# EAGLE schematic monarchdtv (EAGLE 9.6.2)
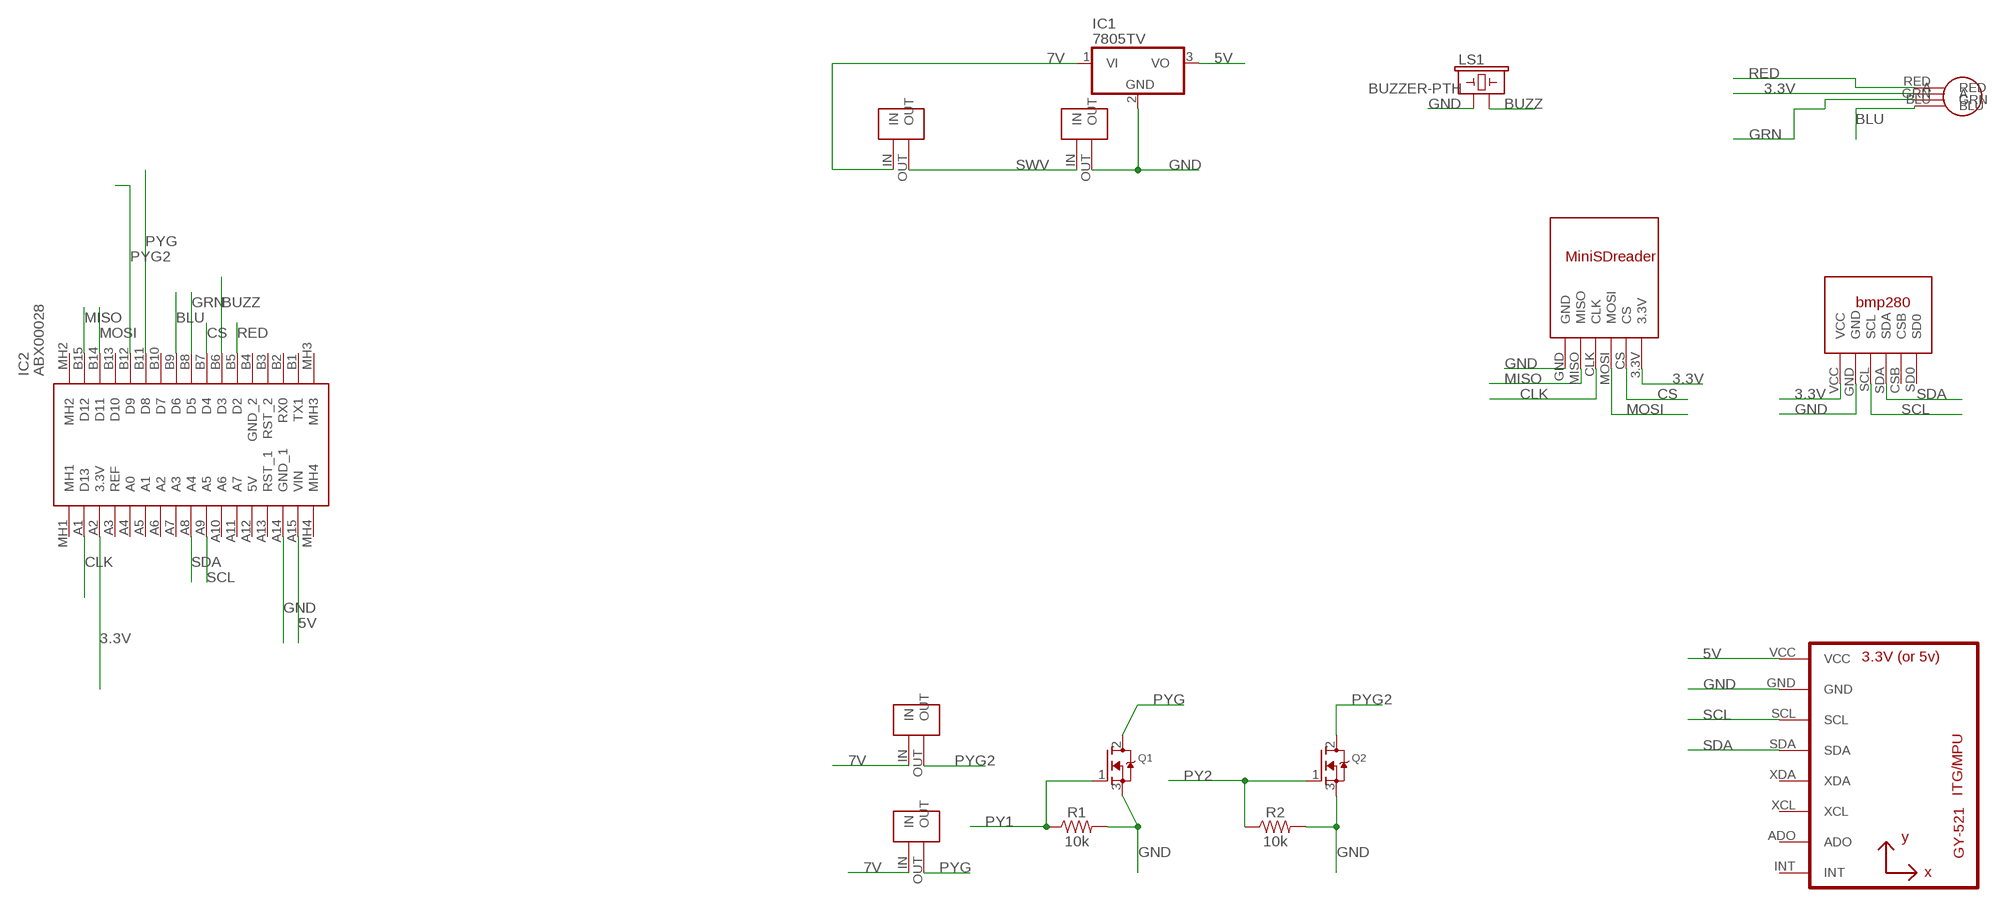
[diagram p0: schematic, sheet 1]

## Parts
IC1  7805TV  [TO220V]
IC2  ABX00028  [ABX00028]
LS1  BUZZER-PTH  [BUZZER-12MM]
Q1  MOSFET-NGDS_TO220V  [TO220V]
Q2  MOSFET-NGDS_TO220V  [TO220V]
R1  10k  10KOHM-VERT_KIT-1/6W-5%  [AXIAL-0.1-KIT]
R2  10k  10KOHM-VERT_KIT-1/6W-5%  [AXIAL-0.1-KIT]
U1  GY-521MPU6050  [GY-521]
U$2  BMP280  [BMP280]
U$3  MINISDREADER  [MINISDREADER]
U$4  SWITCH  [SWITCH]
U$5  SWITCH  [SWITCH]
U$6  SWITCH  [SWITCH]
U$7  SWITCH  [SWITCH]
U$9  LED  [LED]

## Nets
3.3V: IC2.A2(3.3V) U$2.VCC U$3.3.3V U$9.A
5V: IC1.3(VO) IC2.A15(VIN) U1.VCC
7V: IC1.1(VI) U$5.IN U$6.IN U$7.IN
BLU: IC2.B9(D6) U$9.BLU
BUZZ: IC2.B6(D3) LS1.-
CLK: IC2.A1(D13) U$3.CLK
CS: IC2.B7(D4) U$3.CS
GND: IC1.2(GND) IC2.A14(GND_1) LS1.+ Q1.3(S) Q2.3(S) R1.P$2 R2.P$2 U1.GND U$2.GND U$3.GND U$4.OUT
GRN: IC2.B8(D5) U$9.GRN
MISO: IC2.B15(D12) U$3.MISO
MOSI: IC2.B14(D11) U$3.MOSI
PY1: Q1.1(G) R1.P$1
PY2: Q2.1(G) R2.P$1
PYG: IC2.B11(D8) Q1.2(D) U$6.OUT
PYG2: IC2.B12(D9) Q2.2(D) U$5.OUT
RED: IC2.B5(D2) U$9.RED
SCL: IC2.A9(A5) U1.SCL U$2.SCL
SDA: IC2.A8(A4) U1.SDA U$2.SDA
SWV: U$4.IN U$7.OUT
Unconnected: IC2.A3(REF) IC2.A4(A0) IC2.A5(A1) IC2.A6(A2) IC2.A7(A3) IC2.A10(A6) IC2.A11(A7) IC2.A12(5V) IC2.A13(RST_1) IC2.B1(TX1) IC2.B2(RX0) IC2.B3(RST_2) IC2.B4(GND_2) IC2.B10(D7) IC2.B13(D10) IC2.MH1 IC2.MH2 IC2.MH3 IC2.MH4 U1.ADO U1.INT U1.XCL U1.XDA U$2.CSB U$2.SD0

## Library data of the parts
IC1 = linear:78*: Positive VOLTAGE REGULATOR Source: http://cache.national.com/ds/LM/LM78L05.pdf http://www.fairchildsemi.com/ds/LM/LM7805.pdf
IC2 = ABX00028:ABX00028: Development Boards & Kits - AVR Arduino Nano Every Source: Datasheet <https://store.arduino.cc/arduino-nano-every>; ARROW_PART_NUMBER: ABX00028; ARROW_PRICE-STOCK: https://www.arrow.com/en/products/abx00028/arduino-corporation?region=nac; DESCRIPTION: Development Boards & Kits - AVR Arduino Nano Every; HEIGHT: 10mm; MANUFACTURER_NAME: Arduino; MANUFACTURER_PART_NUMBER: ABX00028; MOUSER_PART_NUMBER: 782-ABX00028; MOUSER_PRICE-STOCK: https://www.mouser.co.uk/ProductDetail/Arduino/ABX00028?qs=PzGy0jfpSMtit6rnFl8mVg%3D%3D
LS1 = SparkFun-Electromechanical:BUZZER: Buzzer Small round buzzers that operate around the audible 2kHz range. You can use these as speakers to create simple music or user interfaces. Variant Overview: PTH - Mini Speaker - PC Mount 12mm 2.048kHz <https://www.sparkfun.com/products/7950> PTH_KIT - Mini Speaker - PC Mount 12mm 2.048kHz <https://www.sparkfun.com/products/7950> KIT simplifies soldering by adding stop mask to one side of the pads. PTH_NO_SILK - Mini Speaker - PC Mount 12mm 2.048kHz <https://www.sparkfun.com/products/7950> No silkscreen indicator of buzzer outline. PTH_KIT_NO_SILK - Mini Speaker - PC Mount 12mm 2.048kHz <https://www.sparkfun.com/products/7950> KIT package w/o silkscreen SMD - Buzzer Audio Magnetic (CCV-084B16) SMD buzzer used on, e.g. the LilyPad Buzzer <https://www.sparkfun.com/products/8463> and RFID USB Reader <https://www.sparkfun.com/products/9963>. SMD_KIT - Buzzer Audio Magnetic (CCV-084B16) SMD Buzzer with elongated pins to make soldering easier. Used on the SparkFun Simon Says - Surface Mount Soldering Kit <https://www.sparkfun.com/products/10935>.; PROD_ID: COMP-08253; SF_SKU: COM-07950
Q1 Q2 = adafruit:MOSFET-N: N-Channel Mosfet 2N7002E - 60V 260mA SOT23 [Digikey: 2N7002ET1GOSTR-ND] - REEL BSH103 - 30V 850mA SOT23 [Digikey: 568-5013-1-ND]
R1 R2 = SparkFun-Resistors:10KOHM: 10kΩ resistor A resistor is a passive two-terminal electrical component that implements electrical resistance as a circuit element. Resistors act to reduce current flow, and, at the same time, act to lower voltage levels within circuits. - Wikipedia; PROD_ID: RES-08375
U1 = gy-521:GY-521
U$2 = bmp280:BMP280
U$3 = minisdreader:MINISDREADER
U$4-U$7 = switch:SWITCH
U$9 = led:LED